# EAGLE schematic class h (EAGLE 9.6.2)
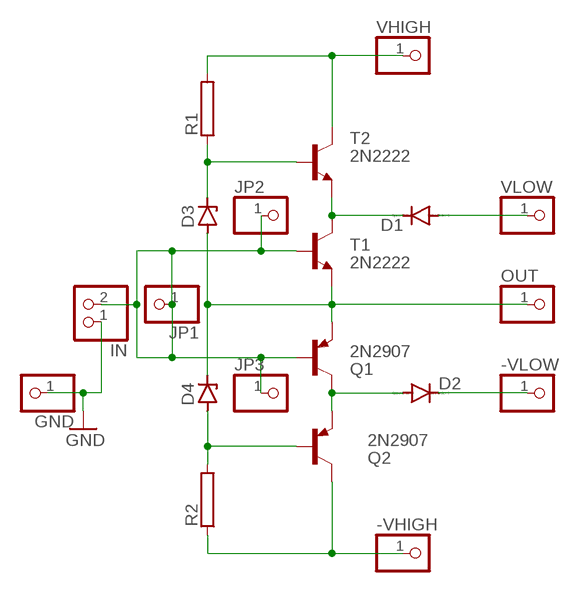
[diagram p0: schematic, sheet 1]

## Parts
-VHIGH  PINHD-1X1  [1X01]
-VLOW  PINHD-1X1  [1X01]
D1  1N4148DO35-7  [DO35-7]
D2  1N4148DO35-7  [DO35-7]
D3  1N4728  [DO41Z10]
D4  1N4728  [DO41Z10]
GND  PINHD-1X1  [1X01]
IN  PINHD-1X2  [1X02]
JP1  PINHD-1X1  [1X01]
JP2  PINHD-1X1  [1X01]
JP3  PINHD-1X1  [1X01]
OUT  PINHD-1X1  [1X01]
Q1  2N2907  [TO18]
Q2  2N2907  [TO18]
R1  RAC01  [AC01]
R2  RAC01  [AC01]
T1  2N2222  [TO18]
T2  2N2222  [TO18]
VHIGH  PINHD-1X1  [1X01]
VLOW  PINHD-1X1  [1X01]

## Nets
GND: GND.1 IN.1
N$1: D3.C R1.1 T2.2(B)
N$2: IN.2 JP1.1 JP2.1 JP3.1 Q1.2(B) T1.2(B)
N$3: D1.A VLOW.1
N$4: D3.A D4.C OUT.1 Q1.1(E) T1.1(E)
N$5: D1.C T1.3(C) T2.1(E)
N$6: D2.A Q1.3(C) Q2.1(E)
N$7: -VHIGH.1 Q2.3(C) R2.1
N$8: R1.2 T2.3(C) VHIGH.1
N$9: D4.A Q2.2(B) R2.2
N$10: -VLOW.1 D2.C

## Library data of the parts
-VHIGH -VLOW GND JP1-JP3 OUT VHIGH VLOW = pinhead:PINHD-1X1: PIN HEADER
D1 D2 = diode:1N4148: DIODE high speed (Philips)
D3 D4 = diode:1N4728: Z DIODE 3.3 V, 1W, 5 percent
IN = pinhead:PINHD-1X2: PIN HEADER
Q1 Q2 = transistor-pnp:2N2907*: PNP Transistor
R1 R2 = resistor-power:R: Power Resitor; OC_FARNELL: unknown; OC_NEWARK: unknown
T1 T2 = transistor:2N2222: NPN TRANSISTOR